# EAGLE schematic i2c2pwm (EAGLE 7.2.0)
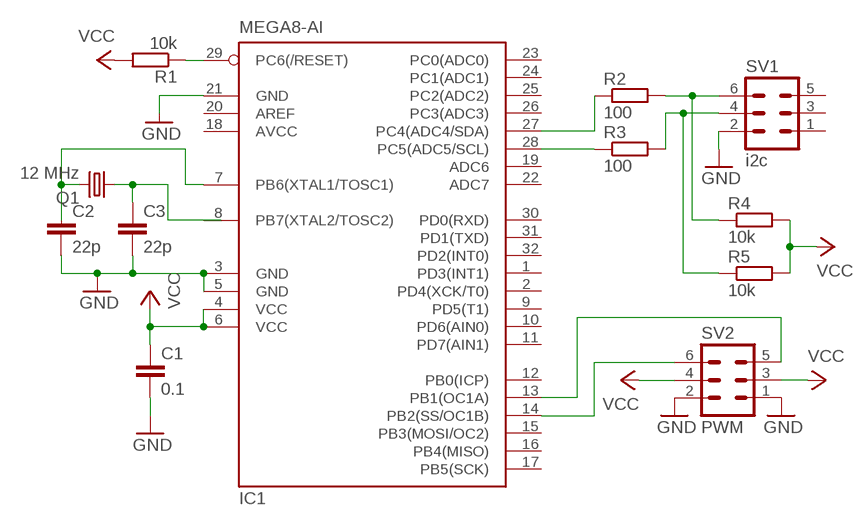
[diagram p0: schematic, sheet 1]

## Parts
C1  0.1  C-EUC0805K  [C0805K]
C2  22p  C-EUC0805K  [C0805K]
C3  22p  C-EUC0805K  [C0805K]
IC1  MEGA8-AI  [TQFP32-08]
Q1  12 MHz  CRYSTALHC49S  [HC49/S]
R1  10k  R-EU_R0805  [R0805]
R2  100  R-EU_R0805  [R0805]
R3  100  R-EU_R0805  [R0805]
R4  10k  R-EU_R0805  [R0805]
R5  10k  R-EU_R0805  [R0805]
SV1  i2c  ML6  [ML6]
SV2  PWM  ML6  [ML6]

## Nets
GND: C1.2 C2.2 C3.2 IC1.3(GND) IC1.5(GND) SV1.2 SV2.1 SV2.2
N$1: IC1.29(PC6(/RESET)) R1.1
N$2: C3.1 Q1.1
N$3: IC1.7(PB6(XTAL1/TOSC1)) Q1.2
N$4: R3.2 R5.1 SV1.4
N$5: R2.2 R4.1 SV1.6
N$6: IC1.21(GND)
N$7: IC1.14(PB2(SS/OC1B)) SV2.6
N$8: IC1.28(PC5(ADC5/SCL)) R3.1
N$9: IC1.27(PC4(ADC4/SDA)) R2.1
N$10: IC1.13(PB1(OC1A)) SV2.5
VCC: C1.1 IC1.4(VCC) IC1.6(VCC) R1.2 R4.2 R5.2 SV2.3 SV2.4
Unconnected: C2.1 IC1.1(PD3(INT1)) IC1.2(PD4(XCK/T0)) IC1.8(PB7(XTAL2/TOSC2)) IC1.9(PD5(T1)) IC1.10(PD6(AIN0)) IC1.11(PD7(AIN1)) IC1.12(PB0(ICP)) IC1.15(PB3(MOSI/OC2)) IC1.16(PB4(MISO)) IC1.17(PB5(SCK)) IC1.19(ADC6) IC1.20(AREF) IC1.22(ADC7) IC1.23(PC0(ADC0)) IC1.24(PC1(ADC1)) IC1.25(PC2(ADC2)) IC1.26(PC3(ADC3)) IC1.30(PD0(RXD)) IC1.31(PD1(TXD)) IC1.32(PD2(INT0)) SV1.1 SV1.3 SV1.5

## Power pins joined to a net without a drawn wire
AVCC: IC1.18(AVCC)

## Library data of the parts
C1-C3 = resistor:C-EU: CAPACITOR, European symbol
IC1 = atmel:MEGA8: MICROCONTROLLER 8 Kbytes FLASH, 1 kbytes SRAM, 512 bytes EEPROM, USART, 6-channel 10 bit ADC, 2-channel 8 bit ADC Pin compatible with Atmega48, ATMega88, ATMega168 Source: avr.lbr; MPN: ATMEGA8-16AU; OC_FARNELL: 9171371; OC_NEWARK: 73M8863
Q1 = crystal:CRYSTAL: CRYSTAL; OC_FARNELL: 1667008; OC_NEWARK: unknown
R1-R5 = resistor:R-EU_: RESISTOR, European symbol
SV1 SV2 = con-harting-ml:ML6: HARTING; OC_FARNELL: unknown; OC_NEWARK: unknown